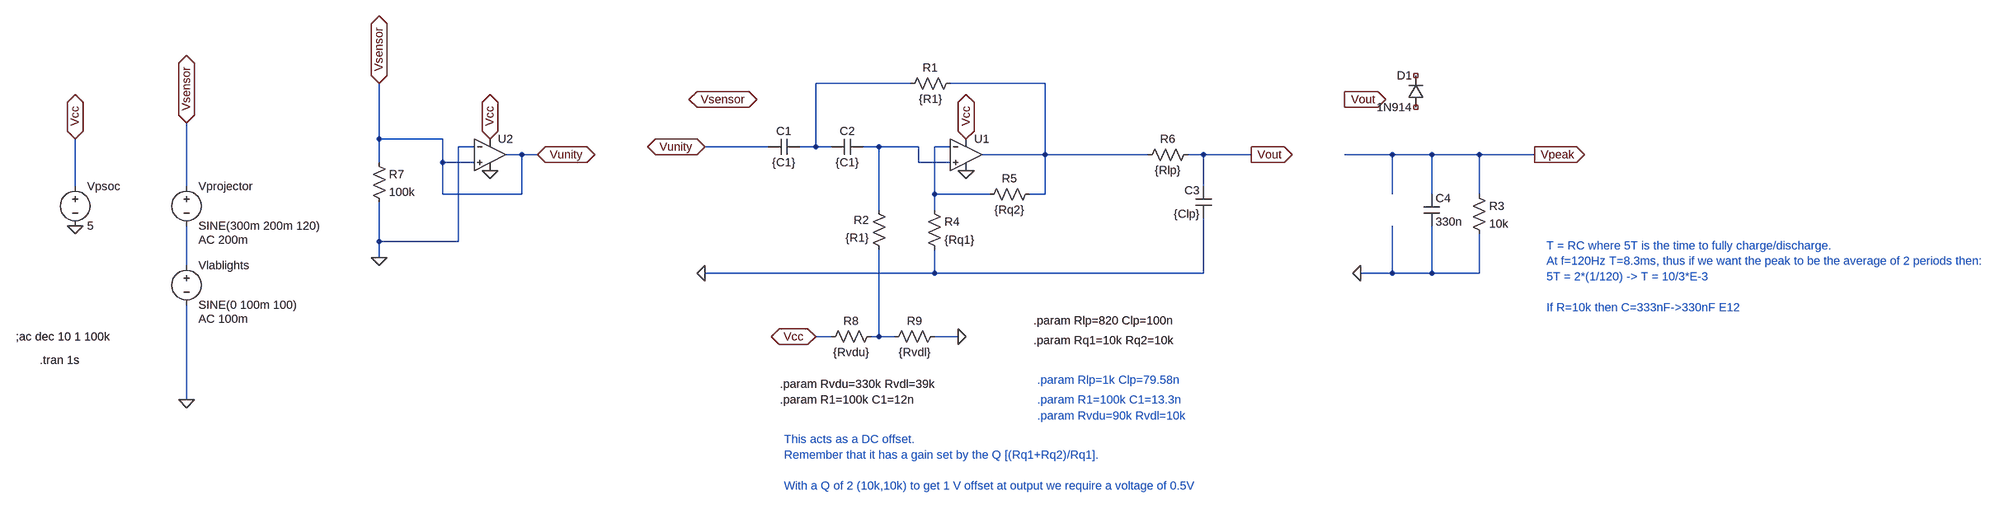
[diagram p0: schematic FilterSchematic_Rev0.asc]
FilterSchematic_Rev0.asc, the LTspice schematic file:
Version 4
SHEET 1 3012 680
WIRE 720 -176 528 -176
WIRE 992 -176 800 -176
WIRE -464 -64 -464 -176
WIRE -336 -64 -464 -64
WIRE -272 -48 -304 -48
WIRE 432 -48 304 -48
WIRE 528 -48 528 -176
WIRE 528 -48 496 -48
WIRE 560 -48 528 -48
WIRE 656 -48 624 -48
WIRE 736 -48 656 -48
WIRE 800 -48 768 -48
WIRE -176 -32 -208 -32
WIRE -144 -32 -176 -32
WIRE 992 -32 992 -176
WIRE 992 -32 864 -32
WIRE 1200 -32 992 -32
WIRE 1312 -32 1280 -32
WIRE 1408 -32 1312 -32
WIRE 1728 -32 1632 -32
WIRE 1808 -32 1728 -32
WIRE 1904 -32 1808 -32
WIRE 2016 -32 1904 -32
WIRE -464 -16 -464 -64
WIRE -336 -16 -336 -64
WIRE -272 -16 -336 -16
WIRE 736 -16 736 -48
WIRE 800 -16 736 -16
WIRE -1280 32 -1280 -64
WIRE -1040 32 -1040 -96
WIRE 1312 32 1312 -32
WIRE -336 48 -336 -16
WIRE -176 48 -176 -32
WIRE -176 48 -336 48
WIRE 768 48 768 -48
WIRE 880 48 768 48
WIRE 992 48 992 -32
WIRE 992 48 960 48
WIRE 1728 48 1728 -32
WIRE 1808 48 1808 -32
WIRE 1904 48 1904 -32
WIRE 656 80 656 -48
WIRE 768 80 768 48
WIRE -464 144 -464 64
WIRE -304 144 -304 -48
WIRE -304 144 -464 144
WIRE -464 176 -464 144
WIRE -1040 192 -1040 112
WIRE 768 208 768 160
WIRE 768 208 304 208
WIRE 1312 208 1312 96
WIRE 1312 208 768 208
WIRE 1728 208 1728 112
WIRE 1728 208 1664 208
WIRE 1808 208 1808 112
WIRE 1808 208 1728 208
WIRE 1904 208 1904 128
WIRE 1904 208 1808 208
WIRE 560 336 528 336
WIRE 656 336 656 160
WIRE 656 336 640 336
WIRE 688 336 656 336
WIRE 816 336 768 336
WIRE -1040 464 -1040 272
FLAG -1040 464 0
FLAG -1040 -96 Vsensor
IOPIN -1040 -96 BiDir
FLAG 272 -144 Vsensor
IOPIN 272 -144 BiDir
FLAG -1280 112 0
FLAG -1280 -64 Vcc
IOPIN -1280 -64 BiDir
FLAG 832 -64 Vcc
IOPIN 832 -64 BiDir
FLAG 832 0 0
FLAG 304 208 0
FLAG 1408 -32 Vout
IOPIN 1408 -32 Out
FLAG 816 336 0
FLAG 528 336 Vcc
IOPIN 528 336 BiDir
FLAG 1664 208 0
FLAG 1632 -144 Vout
IOPIN 1632 -144 Out
FLAG 2016 -32 Vpeak
IOPIN 2016 -32 Out
FLAG -240 0 0
FLAG -240 -64 Vcc
IOPIN -240 -64 BiDir
FLAG -144 -32 Vunity
IOPIN -144 -32 BiDir
FLAG -464 -176 Vsensor
IOPIN -464 -176 BiDir
FLAG 304 -48 Vunity
IOPIN 304 -48 BiDir
FLAG -464 176 0
SYMBOL voltage -1040 16 R0
WINDOW 123 24 124 Left 2
WINDOW 39 0 0 Left 0
SYMATTR Value2 AC 200m
SYMATTR InstName Vprojector
SYMATTR Value SINE(300m 200m 120)
SYMBOL voltage -1040 176 R0
WINDOW 123 24 124 Left 2
WINDOW 39 0 0 Left 0
SYMATTR Value2 AC 100m
SYMATTR InstName Vlablights
SYMATTR Value SINE(0 100m 100)
SYMBOL cap 496 -64 R90
WINDOW 0 0 32 VBottom 2
WINDOW 3 32 32 VTop 2
SYMATTR InstName C1
SYMATTR Value {C1}
SYMBOL cap 624 -64 R90
WINDOW 0 0 32 VBottom 2
WINDOW 3 32 32 VTop 2
SYMATTR InstName C2
SYMATTR Value {C1}
SYMBOL res 816 -192 R90
WINDOW 0 0 56 VBottom 2
WINDOW 3 32 56 VTop 2
SYMATTR InstName R1
SYMATTR Value {R1}
SYMBOL res 672 176 R180
WINDOW 0 36 76 Left 2
WINDOW 3 36 40 Left 2
SYMATTR InstName R2
SYMATTR Value {R1}
SYMBOL OpAmps\\UniversalOpamp2 832 -32 R0
SYMATTR InstName U1
SYMBOL voltage -1280 16 R0
WINDOW 123 0 0 Left 0
WINDOW 39 0 0 Left 0
SYMATTR InstName Vpsoc
SYMATTR Value 5
SYMBOL res 752 64 R0
SYMATTR InstName R4
SYMATTR Value {Rq1}
SYMBOL res 976 32 R90
WINDOW 0 0 56 VBottom 2
WINDOW 3 32 56 VTop 2
SYMATTR InstName R5
SYMATTR Value {Rq2}
SYMBOL cap 1328 96 R180
WINDOW 0 24 56 Left 2
WINDOW 3 24 8 Left 2
SYMATTR InstName C3
SYMATTR Value {Clp}
SYMBOL res 1296 -48 R90
WINDOW 0 0 56 VBottom 2
WINDOW 3 32 56 VTop 2
SYMATTR InstName R6
SYMATTR Value {Rlp}
SYMBOL res 656 320 R90
WINDOW 0 0 56 VBottom 2
WINDOW 3 32 56 VTop 2
SYMATTR InstName R8
SYMATTR Value {Rvdu}
SYMBOL res 784 320 R90
WINDOW 0 0 56 VBottom 2
WINDOW 3 32 56 VTop 2
SYMATTR InstName R9
SYMATTR Value {Rvdl}
SYMBOL diode 1792 -128 R180
WINDOW 0 24 64 Left 2
WINDOW 3 24 0 Left 2
SYMATTR InstName D1
SYMATTR Value 1N914
SYMBOL res 1888 32 R0
SYMATTR InstName R3
SYMATTR Value 10k
SYMBOL cap 1792 48 R0
SYMATTR InstName C4
SYMATTR Value 330n
SYMBOL OpAmps\\UniversalOpamp2 -240 -32 R0
SYMATTR InstName U2
SYMBOL res -480 -32 R0
SYMATTR InstName R7
SYMATTR Value 100k
TEXT 456 464 Left 2 !.param R1=100k C1=12n
TEXT 968 344 Left 2 !.param Rq1=10k Rq2=10k
TEXT -1352 384 Left 2 !.tran 1s
TEXT -1400 336 Left 2 !;ac dec 10 1 100k
TEXT 968 304 Left 2 !.param Rlp=820 Clp=100n
TEXT 456 432 Left 2 !.param Rvdu=330k Rvdl=39k
TEXT 464 544 Left 2 ;This acts as a DC offset.\nRemember that it has a gain set by the Q [(Rq1+Rq2)/Rq1].\n \nWith a Q of 2 (10k,10k) to get 1 V offset at output we require a voltage of 0.5V
TEXT 976 464 Left 2 ;.param R1=100k C1=13.3n
TEXT 976 496 Left 2 ;.param Rvdu=90k Rvdl=10k
TEXT 976 424 Left 2 ;.param Rlp=1k Clp=79.58n
TEXT 2040 152 Left 2 ;T = RC where 5T is the time to fully charge/discharge.\nAt f=120Hz T=8.3ms, thus if we want the peak to be the average of 2 periods then:\n5T = 2*(1/120) -> T = 10/3*E-3\n \nIf R=10k then C=333nF->330nF E12

The netlist it stands for:
* FilterSchematic_Rev0.asc
Vprojector Vunity N005 SINE(300m 200m 120) AC 200m
Vlablights N005 0 SINE(0 100m 100) AC 100m
C1 N001 Vunity {C1}
C2 N003 N001 {C1}
R1 N002 N001 {R1}
R2 N006 N003 {R1}
XU1 N003 N004 Vcc 0 N002 level.2 Avol=1Meg GBW=10Meg Slew=10Meg ilimit=25m rail=0 Vos=0 phimargin=45 en=0 enk=0 in=0 ink=0 Rin=500Meg  ; pins IN+ IN- V+ V- OUT
Vpsoc Vcc 0 5
R4 N004 0 {Rq1}
R5 N002 N004 {Rq2}
C3 0 Vout {Clp}
R6 Vout N002 {Rlp}
R8 N006 Vcc {Rvdu}
R9 0 N006 {Rvdl}
D1 NC_01 NC_02 1N914
R3 Vpeak 0 10k
C4 Vpeak 0 330n
XU2 Vunity 0 Vcc 0 Vunity level.2 Avol=1Meg GBW=10Meg Slew=10Meg ilimit=25m rail=0 Vos=0 phimargin=45 en=0 enk=0 in=0 ink=0 Rin=500Meg  ; pins IN+ IN- V+ V- OUT
R7 Vunity 0 100k
.model D D
.lib standard.dio
.param R1=100k C1=12n
.param Rq1=10k Rq2=10k
.tran 1s
;ac dec 10 1 100k
.param Rlp=820 Clp=100n
.param Rvdu=330k Rvdl=39k
* This acts as a DC offset.
* Remember that it has a gain set by the Q [(Rq1+Rq2)/Rq1].
* With a Q of 2 (10k,10k) to get 1 V offset at output we require a voltage of 0.5V
* .param R1=100k C1=13.3n
* .param Rvdu=90k Rvdl=10k
* .param Rlp=1k Clp=79.58n
* T = RC where 5T is the time to fully charge/discharge.
* At f=120Hz T=8.3ms, thus if we want the peak to be the average of 2 periods then:
* 5T = 2*(1/120) -> T = 10/3*E-3
* If R=10k then C=333nF->330nF E12
.lib UniversalOpamps2.sub
.backanno
.end